# Altium schematic sheet IO Headers.SchDoc
size A4; SheetNumber: 3; SheetTotal: 5
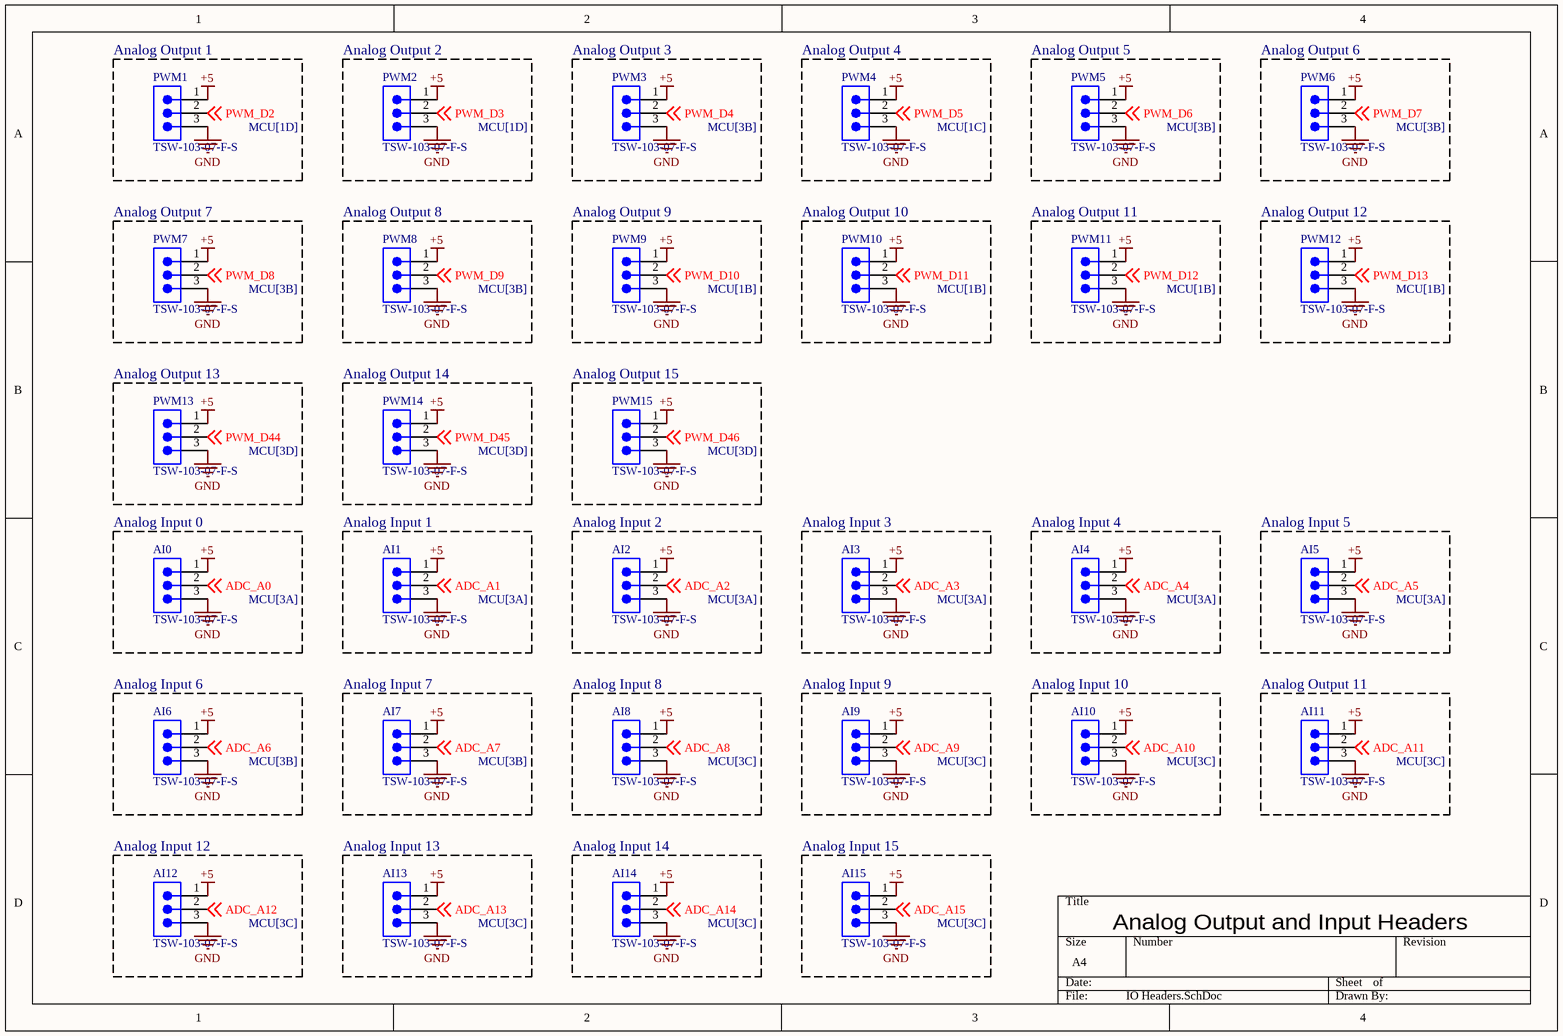
[diagram p0: IO Headers.SchDoc]

## Parts
AI0  TSW-103-07-F-S  [SMTC-TSW-103-07-X-S]
AI1  TSW-103-07-F-S  [SMTC-TSW-103-07-X-S]
AI2  TSW-103-07-F-S  [SMTC-TSW-103-07-X-S]
AI3  TSW-103-07-F-S  [SMTC-TSW-103-07-X-S]
AI4  TSW-103-07-F-S  [SMTC-TSW-103-07-X-S]
AI5  TSW-103-07-F-S  [SMTC-TSW-103-07-X-S]
AI6  TSW-103-07-F-S  [SMTC-TSW-103-07-X-S]
AI7  TSW-103-07-F-S  [SMTC-TSW-103-07-X-S]
AI8  TSW-103-07-F-S  [SMTC-TSW-103-07-X-S]
AI9  TSW-103-07-F-S  [SMTC-TSW-103-07-X-S]
AI10  TSW-103-07-F-S  [SMTC-TSW-103-07-X-S]
AI11  TSW-103-07-F-S  [SMTC-TSW-103-07-X-S]
AI12  TSW-103-07-F-S  [SMTC-TSW-103-07-X-S]
AI13  TSW-103-07-F-S  [SMTC-TSW-103-07-X-S]
AI14  TSW-103-07-F-S  [SMTC-TSW-103-07-X-S]
AI15  TSW-103-07-F-S  [SMTC-TSW-103-07-X-S]
PWM1  TSW-103-07-F-S  [SMTC-TSW-103-07-X-S]
PWM2  TSW-103-07-F-S  [SMTC-TSW-103-07-X-S]
PWM3  TSW-103-07-F-S  [SMTC-TSW-103-07-X-S]
PWM4  TSW-103-07-F-S  [SMTC-TSW-103-07-X-S]
PWM5  TSW-103-07-F-S  [SMTC-TSW-103-07-X-S]
PWM6  TSW-103-07-F-S  [SMTC-TSW-103-07-X-S]
PWM7  TSW-103-07-F-S  [SMTC-TSW-103-07-X-S]
PWM8  TSW-103-07-F-S  [SMTC-TSW-103-07-X-S]
PWM9  TSW-103-07-F-S  [SMTC-TSW-103-07-X-S]
PWM10  TSW-103-07-F-S  [SMTC-TSW-103-07-X-S]
PWM11  TSW-103-07-F-S  [SMTC-TSW-103-07-X-S]
PWM12  TSW-103-07-F-S  [SMTC-TSW-103-07-X-S]
PWM13  TSW-103-07-F-S  [SMTC-TSW-103-07-X-S]
PWM14  TSW-103-07-F-S  [SMTC-TSW-103-07-X-S]
PWM15  TSW-103-07-F-S  [SMTC-TSW-103-07-X-S]

## Blocks framed on the sheet
Analog Output 1: PWM1
Analog Output 2: PWM2
Analog Output 3: PWM3
Analog Output 4: PWM4
Analog Output 5: PWM5
Analog Output 6: PWM6
Analog Output 7: PWM7
Analog Output 8: PWM8
Analog Output 9: PWM9
Analog Output 10: PWM10
Analog Output 11: PWM11
Analog Output 12: PWM12
Analog Output 13: PWM13
Analog Output 14: PWM14
Analog Output 15: PWM15
Analog Input 0: AI0
Analog Input 1: AI1
Analog Input 2: AI2
Analog Input 3: AI3
Analog Input 4: AI4
Analog Input 5: AI5
Analog Input 6: AI6
Analog Input 7: AI7
Analog Input 8: AI8
Analog Input 9: AI9
Analog Input 10: AI10
Analog Output 11: AI11
Analog Input 12: AI12
Analog Input 13: AI13
Analog Input 14: AI14
Analog Input 15: AI15

## Nets
+5: AI0.1 AI1.1 AI2.1 AI3.1 AI4.1 AI5.1 AI6.1 AI7.1 AI8.1 AI9.1 AI10.1 AI11.1 AI12.1 AI13.1 AI14.1 AI15.1 PWM1.1 PWM2.1 PWM3.1 PWM4.1 PWM5.1 PWM6.1 PWM7.1 PWM8.1 PWM9.1 PWM10.1 PWM11.1 PWM12.1 PWM13.1 PWM14.1 PWM15.1
GND: AI0.3 AI1.3 AI2.3 AI3.3 AI4.3 AI5.3 AI6.3 AI7.3 AI8.3 AI9.3 AI10.3 AI11.3 AI12.3 AI13.3 AI14.3 AI15.3 PWM1.3 PWM2.3 PWM3.3 PWM4.3 PWM5.3 PWM6.3 PWM7.3 PWM8.3 PWM9.3 PWM10.3 PWM11.3 PWM12.3 PWM13.3 PWM14.3 PWM15.3
ADC_A0: AI0.2 ; off-sheet ADC_A0
ADC_A1: AI1.2 ; off-sheet ADC_A1
ADC_A2: AI2.2 ; off-sheet ADC_A2
ADC_A3: AI3.2 ; off-sheet ADC_A3
ADC_A4: AI4.2 ; off-sheet ADC_A4
ADC_A5: AI5.2 ; off-sheet ADC_A5
ADC_A6: AI6.2 ; off-sheet ADC_A6
ADC_A7: AI7.2 ; off-sheet ADC_A7
ADC_A8: AI8.2 ; off-sheet ADC_A8
ADC_A9: AI9.2 ; off-sheet ADC_A9
ADC_A10: AI10.2 ; off-sheet ADC_A10
ADC_A11: AI11.2 ; off-sheet ADC_A11
ADC_A12: AI12.2 ; off-sheet ADC_A12
ADC_A13: AI13.2 ; off-sheet ADC_A13
ADC_A14: AI14.2 ; off-sheet ADC_A14
ADC_A15: AI15.2 ; off-sheet ADC_A15
PWM_D2: PWM1.2 ; off-sheet PWM_D2
PWM_D3: PWM2.2 ; off-sheet PWM_D3
PWM_D4: PWM3.2 ; off-sheet PWM_D4
PWM_D5: PWM4.2 ; off-sheet PWM_D5
PWM_D6: PWM5.2 ; off-sheet PWM_D6
PWM_D7: PWM6.2 ; off-sheet PWM_D7
PWM_D8: PWM7.2 ; off-sheet PWM_D8
PWM_D9: PWM8.2 ; off-sheet PWM_D9
PWM_D10: PWM9.2 ; off-sheet PWM_D10
PWM_D11: PWM10.2 ; off-sheet PWM_D11
PWM_D12: PWM11.2 ; off-sheet PWM_D12
PWM_D13: PWM12.2 ; off-sheet PWM_D13
PWM_D44: PWM13.2 ; off-sheet PWM_D44
PWM_D45: PWM14.2 ; off-sheet PWM_D45
PWM_D46: PWM15.2 ; off-sheet PWM_D46

## Notes on the sheet
- Analog Output and Input Headers

## Library data of the parts
AI0-AI15 PWM1-PWM15 = CMP-1024-00331-1: 0.025" SQ Post Header, Through-hole, Vertical, -55 to 125 degC, 2.54 mm Pitch, 3-Pin, Male, RoHS; Manufacturer: Samtec; Pitch: 2.54 mm; DatasheetVersion: F-214; ComponentLink1Description: Manufacturer URL; ComponentLink3URL: http://www.samtec.com/documents/webfiles/cpdf/TSW-XXX-XX-XXX-X-XX-XXX-MKT.pdf; Mounting Technology: Through-hole; PackageDescription: .025[0.64] SQ. Post Terminal Strip Assembly; Temperature Range: -55 to 125 degC; ComponentLink3Description: Package Specification; Orientation: Vertical; PartNumber: TSW-103-07-F-S; RoHS: True; PackageVersion: DM, 8/1988; ComponentLink2Description: Datasheet; ComponentLink1URL: http://www.samtec.com; ComponentLink2URL: http://www.samtec.com/documents/webfiles/pdf/TSW_TH.PDF; PackageReference: TSW-103-07-X-S